# EAGLE board Envelope (EAGLE 7.7.0)
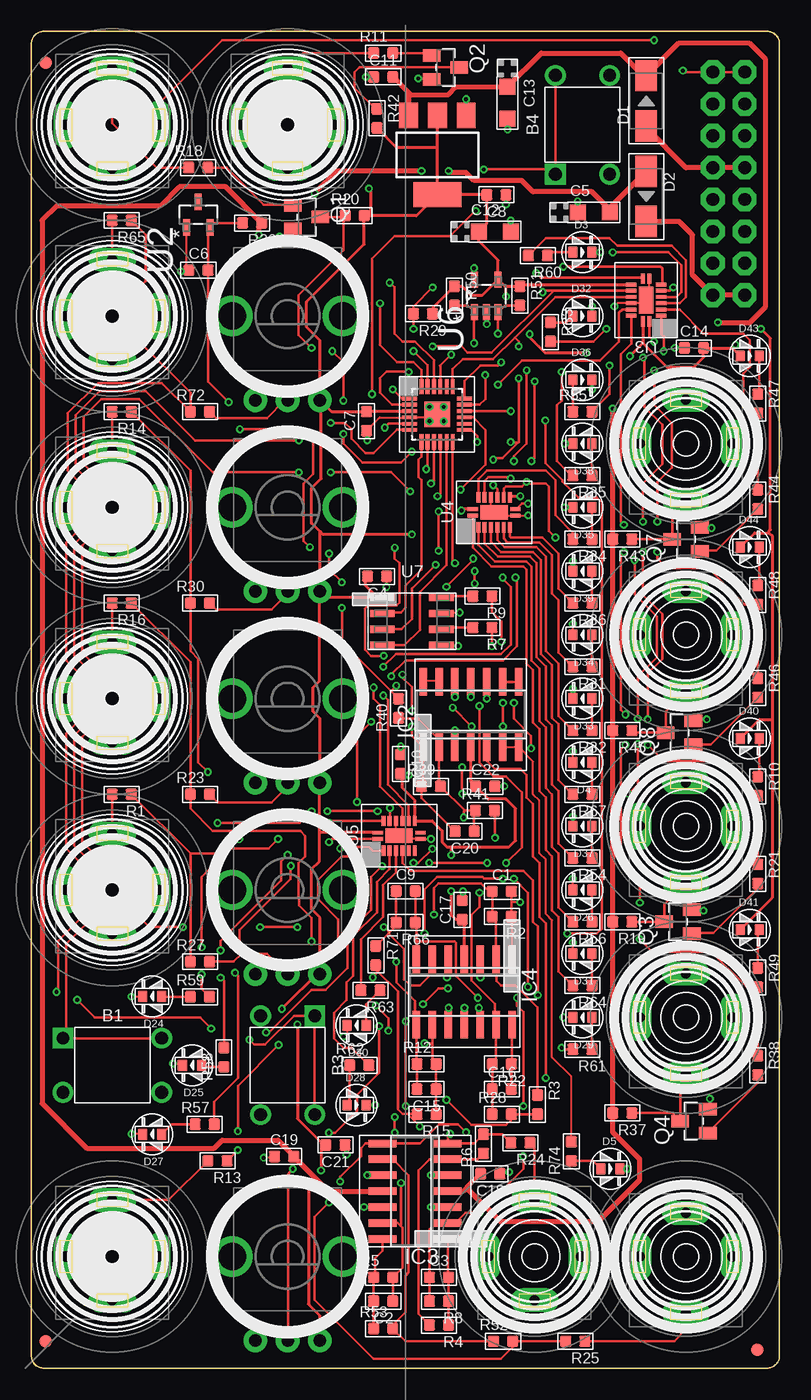
[diagram p2: board, top side]
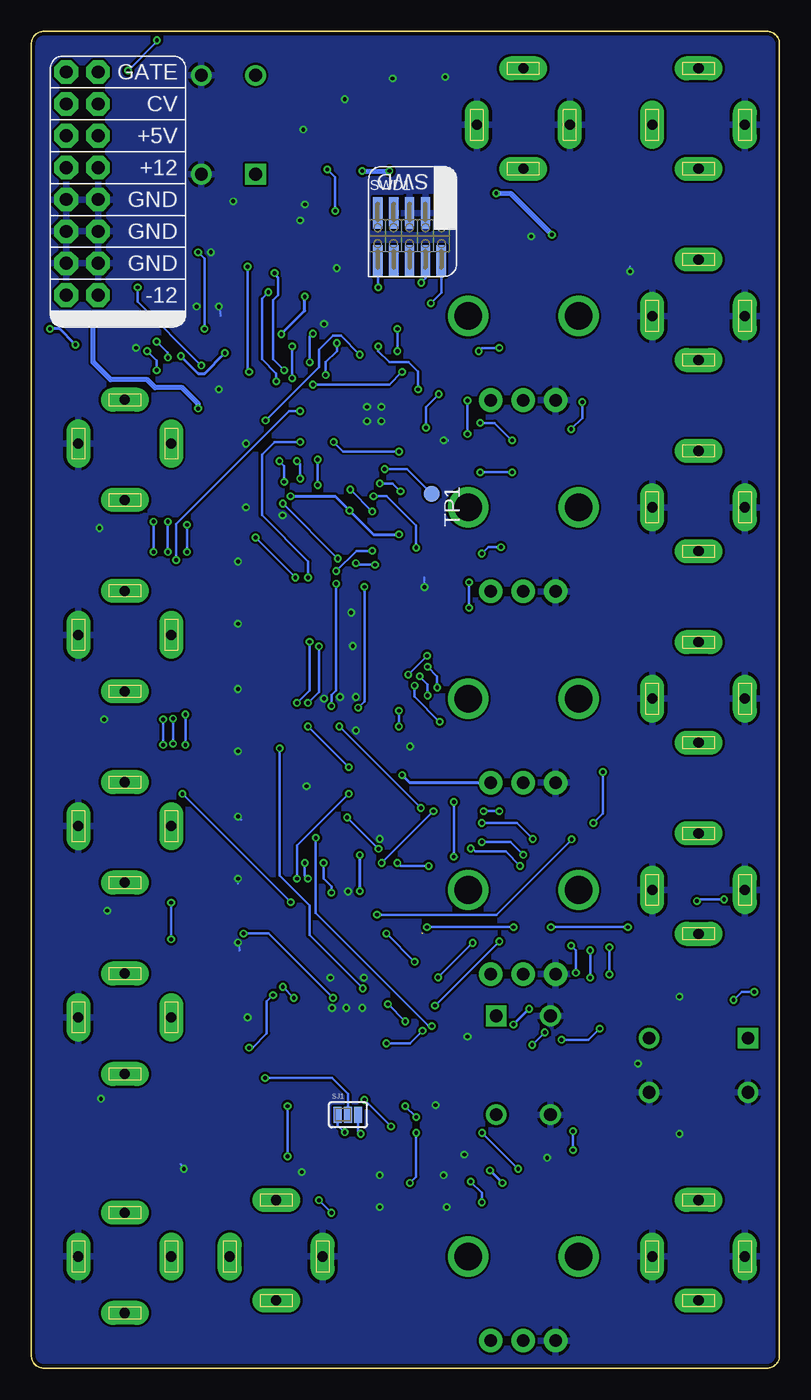
[diagram p3: board, bottom side, seen from below]

Size 59.62 x 106.5 mm. Coordinates in mm from the lower left corner, seen from the top.
Copper layers (1*16): Top 0.035mm / dielectric 1.5mm / Bottom 0.035mm
Design rules "dirt_cheap_dirty_boards.v1 *": minimum track width 5mil, minimum drill 12mil, track to track 5mil, track to pad 5mil, pad to pad 5mil, via to via 5mil, smd to smd 0mil, copper to edge 10mil, drill to drill 10mil, minimum pad ring 10mil, minimum via ring 6mil, stop-mask expansion 2mil, vias tented up to drill 25mil, thermal gap 10mil
Net classes: 0 default: width 0.203 mm, clearance 0.178 mm; 1 heavypower: width 0.381 mm; 2 mediumpower: width 0.254 mm; 3 groundplane: width 0.178 mm, clearance 0.178 mm

## Footprints (pad centres in the part's own frame; a part is rotated, then mirrored left to right if it is on the bottom)
4P-6.0X6.0X5.0H = drill 1.016 pad 1.651 square: 1 -3.937,2.159 | drill 1.016 pad 1.651: 2 -3.937,-2.159; 3 3.937,-2.159; 4 3.937,2.159
C0603 = smd 0.889 x 0.889: 1 -0.762,0; 2 0.762,0
AVX-A = smd 1.27 x 1.27: + -1.27,0; - 1.27,0
DO-214AC = smd 2.5 x 1.7: 1 -2,0; 2 2,0
LED0603 = smd 0.762 x 0.889: + -0.762,0; - 0.762,0
FIDUCIAL_1MM = smd 1 x 1: 1 0,0
SOT223 = smd 1.5 x 2: 1 -2.3,-3.15; 2 0,-3.15; 3 2.3,-3.15 | smd 3.8 x 2: 4 0,3.15
SO14 = smd 0.6 x 2.2: 1 -3.81,-2.6; 2 -2.54,-2.6; 3 -1.27,-2.6; 4 0,-2.6; 5 1.27,-2.6; 6 2.54,-2.6; 7 3.81,-2.6; 8 3.81,2.6; 9 2.54,2.6; 10 1.27,2.6; 11 0,2.6; 12 -1.27,2.6; 13 -2.54,2.6; 14 -3.81,2.6
3.5MM-JACK-SWITCH-13MM-INPUT = drill 0.8 pad 1.93 long: RING@3 -3.7,0; SECOND@3 0,-3.5; SWITCH@3 3.7,0; TIP@3 0,4.5
3.5MM-JACK-SWITCH-13MM-OUTPUT = drill 0.8 pad 1.93 long: RING@3 -3.7,0; SECOND@3 0,-3.5; SWITCH@3 3.7,0; TIP@3 0,4.5
POWER_16 = drill 1.016 pad 1.88 octagon: 1 -6.35,-1.27; 2 -6.35,1.27; 3 -3.81,-1.27; 4 -3.81,1.27; 5 -1.27,-1.27; 6 -1.27,1.27; 7 1.27,-1.27; 8 1.27,1.27; 9 3.81,-1.27; 10 3.81,1.27; 11 6.35,-1.27; 12 6.35,1.27; 13 8.89,-1.27; 14 8.89,1.27; 15 11.43,-1.27; 16 11.43,1.27
SOT23-BEC = smd 1 x 1.4: B -0.95,-1.1; C 0,1.1; E 0.95,-1.1
R0603 = smd 0.889 x 0.889: 1 -0.762,0; 2 0.762,0
OG-POTS_ALPS_POT_VERTICAL = drill 1 pad 1.88: P$1 -2.58,-6.7; P$2 0,-6.7; P$3 2.58,-6.7 | drill 2.2 pad 3.175: P$4 4.4,0; P$5 -4.4,0
SJ_3_PASTE1&2 = smd 0.635 x 1.27: 1 -0.813,0; 2 0,0; 3 0.813,0
M50-3600542 = smd 0.75 x 2.5: 1 -2.54,-1.81; 2 -2.54,2; 3 -1.27,-1.81; 4 -1.27,2; 5 0,-1.81; 6 0,2; 7 1.27,-1.81; 8 1.27,2; 9 2.54,-1.81; 10 2.54,2
B1,27 = smd 1.27 x 1.27: TP 0,0
QFN50P400X400X100-25N = smd 1.2 x 0.3: 1 -2.2,1.245; 2 -2.2,0.762; 3 -2.2,0.254; 4 -2.2,-0.254; 5 -2.2,-0.762; 6 -2.2,-1.245; 13 2.2,-1.245; 14 2.2,-0.762; 15 2.2,-0.254; 16 2.2,0.254; 17 2.2,0.762; 18 2.2,1.245 | smd 0.3 x 1.2: 7 -1.245,-2.2; 8 -0.762,-2.2; 9 -0.254,-2.2; 10 0.254,-2.2; 11 0.762,-2.2; 12 1.245,-2.2; 19 1.245,2.2; 20 0.762,2.2; 21 0.254,2.2; 22 -0.254,2.2 | smd 0.305 x 1.2: 23 -0.762,2.2; 24 -1.245,2.2 | smd 2.032 x 2.032: 25 0,0
SOT95P237X112-3N = smd 1.321 x 0.559: 1 -1.016,0.94; 2 -1.016,-0.94; 3 1.016,0
QFN50P250X350X100-17N = smd 0.305 x 0.813: 1 -0.254,1.702; 8 -0.254,-1.702; 9 0.254,-1.702; 16 0.254,1.702 | smd 0.813 x 0.305: 2 -1.194,1.245; 3 -1.194,0.762; 4 -1.194,0.254; 5 -1.194,-0.254; 6 -1.194,-0.762; 7 -1.194,-1.245; 10 1.194,-1.245; 11 1.194,-0.762; 12 1.194,-0.254; 13 1.194,0.254; 14 1.194,0.762; 15 1.194,1.245 | smd 1.143 x 2.159: 17 0,0
SOT95P290X145-5N = smd 1.27 x 0.559: 1 -1.295,0.94; 2 -1.295,0; 3 -1.295,-0.94; 4 1.295,-0.94; 5 1.295,0.94
SOIC8-N_MC = smd 1.981 x 0.559: 1 -2.362,1.905; 2 -2.362,0.635; 3 -2.362,-0.635; 4 -2.362,-1.905; 5 2.362,-1.905; 6 2.362,-0.635; 7 2.362,0.635; 8 2.362,1.905

## Placement (x,y rotation side)
B1  BUTTON-4P-3110040P1  [4P-6.0X6.0X5.0H]  6.45,24.13 0 top
B3  BUTTON-4P-3110040P1  [4P-6.0X6.0X5.0H]  20.42,24.13 270 top
B4  BUTTON-4P-3110040P1  [4P-6.0X6.0X5.0H]  43.91,99.06 90 top
C1  3.3nF  [C0603]  37.49,37.98 0 top
C2  3.3nF  [C0603]  28.04,5.33 180 top
C3  3.3nF  [C0603]  32.48,7.24 0 top
C4  100nF  [C0603]  27.55,63.08 180 top
C5  10uF  [AVX-A]  44.82,92.08 0 top
C6  100nF  [C0603]  13.31,87.47 0 top
C7  100nF  [C0603]  26.7,75.45 90 top
C8  100nF  [C0603]  37.06,93.47 180 top
C9  3.3nF  [C0603]  29.83,38 0 top
C10  100nF  [C0603]  29.4,48.12 270 top
C11  100nF  [C0603]  28.04,102.87 0 top
C12  10uF  [AVX-A]  36.93,90.55 0 top
C13  10uF  [AVX-A]  37.93,100.8 270 top
C14  100nF  [C0603]  52.8,81.28 0 top
C15  3.3nF  [C0603]  31.49,22.23 180 top
C16  3.3nF  [C0603]  37.49,22.23 0 top
C17  100nF  [C0603]  34.33,36.5 90 top
C18  100nF  [C0603]  36.57,15.49 180 top
C19  100nF  [C0603]  20.14,16.86 0 top
C20  3.3nF  [C0603]  34.52,42.77 180 top
C21  100nF  [C0603]  24.23,17.78 180 top
C22  100nF  [C0603]  36.17,46.35 0 top
D1  MRA4004T3G  [DO-214AC]  48.99,100.97 90 top
D2  MRA4004T3G  [DO-214AC]  48.99,93.34 270 top
D3  yellow  [LED0603]  43.91,88.9 0 top
D4  yellow  [LED0603]  43.91,48.26 180 top
D5  yellow  [LED0603]  46.14,15.88 0 top
D24  yellow  [LED0603]  9.62,29.62 180 top
D25  yellow  [LED0603]  12.8,24.13 180 top
D26  yellow  [LED0603]  43.91,38.1 180 top
D27  yellow  [LED0603]  9.62,18.63 180 top
D28  yellow  [LED0603]  25.92,20.95 0 top
D29  yellow  [LED0603]  43.91,27.94 180 top
D30  yellow  [LED0603]  25.92,27.3 180 top
D31  yellow  [LED0603]  43.91,33.02 180 top
D32  yellow  [LED0603]  43.91,83.82 0 top
D33  yellow  [LED0603]  43.91,53.34 180 top
D34  yellow  [LED0603]  43.91,58.42 180 top
D35  yellow  [LED0603]  43.91,68.58 180 top
D36  yellow  [LED0603]  43.91,78.74 0 top
D37  yellow  [LED0603]  43.91,43.18 180 top
D38  yellow  [LED0603]  43.91,73.66 180 top
D39  yellow  [LED0603]  43.91,63.5 180 top
D40  yellow  [LED0603]  57.25,50.16 0 top
D41  yellow  [LED0603]  57.25,34.92 0 top
D43  yellow  [LED0603]  57.25,80.64 0 top
D44  yellow  [LED0603]  57.25,65.41 0 top
FID1  FIDUCIAL  [FIDUCIAL_1MM]  1.15,104.01 180 top
FID2  FIDUCIAL  [FIDUCIAL_1MM]  57.86,1.46 0 top
FID3  FIDUCIAL  [FIDUCIAL_1MM]  1.13,2.13 0 top
IC1  LD1117AS33TR  [SOT223]  32.36,96.65 180 top
IC2  MCP6004  [SO14]  35.02,52.07 0 top
IC3  TL074D  [SO14]  30.58,14.1 90 top
IC4  MCP6004  [SO14]  34.49,29.98 180 top
J1  PJ-341  [3.5MM-JACK-SWITCH-13MM-INPUT]  6.45,68.58 0 top
J2  PJ-341  [3.5MM-JACK-SWITCH-13MM-INPUT]  6.45,53.34 0 top
J3  PJ-341  [3.5MM-JACK-SWITCH-13MM-INPUT]  6.45,38.1 0 top
J4  PJ-341  [3.5MM-JACK-SWITCH-13MM-INPUT]  6.45,8.89 0 top
J5  PJ-341  [3.5MM-JACK-SWITCH-13MM-INPUT]  6.45,99.06 0 top
J6  PJ-341  [3.5MM-JACK-SWITCH-13MM-INPUT]  20.42,99.06 0 top
J7  PJ-341  [3.5MM-JACK-SWITCH-13MM-OUTPUT]  52.17,43.18 180 top
J8  PJ-341  [3.5MM-JACK-SWITCH-13MM-OUTPUT]  52.17,27.94 180 top
J10  PJ-341  [3.5MM-JACK-SWITCH-13MM-OUTPUT]  52.17,73.66 180 top
J11  PJ-341  [3.5MM-JACK-SWITCH-13MM-OUTPUT]  52.17,58.42 180 top
J12  PJ-341  [3.5MM-JACK-SWITCH-13MM-OUTPUT]  40.1,8.89 0 top
J13  PJ-341  [3.5MM-JACK-SWITCH-13MM-OUTPUT]  52.17,8.89 180 top
J14  POWER  [POWER_16]  55.57,91.83 90 bottom
J15  PJ-341  [3.5MM-JACK-SWITCH-13MM-INPUT]  6.45,83.82 0 top
OUTLINE  EURORACK_PCB12HP  [EURORACK12HPPCB]  -0.5,0 0 top
Q1  MMBT3904  [SOT23-BEC]  21.94,91.7 270 top
Q2  MMBT3904  [SOT23-BEC]  32.99,103.63 270 top
Q3  MMBT3904  [SOT23-BEC]  51.53,35.56 90 top
Q4  MMBT3904  [SOT23-BEC]  52.8,19.68 90 top
Q7  MMBT3904  [SOT23-BEC]  52.17,66.04 90 top
Q8  MMBT3904  [SOT23-BEC]  51.66,50.62 90 top
R1  100k  [R0603]  7.2,45.72 180 top
R2  33k  [R0603]  37.49,35.98 180 top
R3  51k  [R0603]  40.34,21 270 top
R4  100k  [R0603]  32.48,3.43 180 top
R5  30k  [R0603]  28.04,7.24 0 top
R6  100k  [R0603]  36.03,17.88 90 top
R7  12k  [R0603]  35.94,59 180 top
R8  30k  [R0603]  32.48,5.33 180 top
R9  12k  [R0603]  35.94,61.5 180 top
R10  56  [R0603]  57.88,46.35 270 top
R11  100k  [R0603]  28.04,104.78 0 top
R12  33k  [R0603]  31.49,24.23 0 top
R13  100k  [R0603]  14.83,16.51 180 top
R14  100k  [R0603]  7.2,76.2 180 top
R15  51k  [R0603]  31.49,20.23 180 top
R16  100k  [R0603]  7.2,60.96 180 top
R17  10kB  [OG-POTS_ALPS_POT_VERTICAL]  20.42,68.58 0 top
R18  100k  [R0603]  13.3,95.65 0 top
R19  10k  [R0603]  47.09,35.56 180 top
R20  10k  [R0603]  25.77,91.81 0 top
R21  100k  [R0603]  57.88,39.37 270 top
R22  33k  [R0603]  37.49,24.23 180 top
R23  33k  [R0603]  13.44,45.72 0 top
R24  100  [R0603]  38.98,17.96 180 top
R25  100  [R0603]  43.35,2.13 180 top
R26  10k  [R0603]  17.59,91.23 180 top
R27  33k  [R0603]  13.44,32.38 0 top
R28  51k  [R0603]  37.49,20.23 0 top
R29  10k  [R0603]  31.2,84 180 top
R30  33k  [R0603]  13.44,60.96 0 top
R31  56  [R0603]  43.91,55.88 180 top
R32  56  [R0603]  43.91,50.8 180 top
R33  56  [R0603]  41.38,82.55 270 top
R34  56  [R0603]  43.91,66.04 180 top
R35  56  [R0603]  43.91,71.12 180 top
R36  56  [R0603]  43.91,60.96 180 top
R37  10k  [R0603]  47.09,20.32 180 top
R38  100k  [R0603]  57.88,24.13 270 top
R39  33k  [R0603]  31.85,46.35 0 top
R40  51k  [R0603]  29.26,52.57 90 top
R41  33k  [R0603]  36.15,44.42 0 top
R42  10k  [R0603]  27.53,99.57 270 top
R43  10k  [R0603]  47.09,66.04 180 top
R44  100k  [R0603]  57.88,69.22 270 top
R45  10k  [R0603]  47.09,50.8 180 top
R46  100k  [R0603]  57.88,54.19 270 top
R47  56  [R0603]  57.88,76.83 270 top
R48  56  [R0603]  57.88,61.59 270 top
R49  56  [R0603]  57.88,31.11 270 top
R50  2k  [R0603]  33.71,85.43 270 top
R51  2k  [R0603]  38.93,85.43 270 top
R52  100k  [R0603]  37.6,2.13 0 top
R53  100k  [R0603]  28.03,3.15 0 top
R54  56  [R0603]  43.91,40.64 180 top
R55  56  [R0603]  43.91,76.2 0 top
R56  56  [R0603]  43.91,35.56 180 top
R57  56  [R0603]  13.82,19.43 0 top
R58  56  [R0603]  15.34,24.77 90 top
R59  56  [R0603]  13.44,29.59 0 top
R60  56  [R0603]  40.36,88.65 180 top
R61  56  [R0603]  43.91,25.4 180 top
R62  56  [R0603]  26.13,24.13 0 top
R63  56  [R0603]  27.02,30.1 180 top
R64  56  [R0603]  43.91,30.48 180 top
R65  100k  [R0603]  7.2,91.44 180 top
R66  33k  [R0603]  29.83,35.5 180 top
R67  56  [R0603]  43.91,45.72 180 top
R68  10kB  [OG-POTS_ALPS_POT_VERTICAL]  20.42,53.34 0 top
R69  10kB  [OG-POTS_ALPS_POT_VERTICAL]  20.42,38.1 0 top
R70  10kB  [OG-POTS_ALPS_POT_VERTICAL]  20.42,8.89 0 top
R71  51k  [R0603]  27.45,32.87 270 top
R72  33k  [R0603]  13.44,76.2 0 top
R73  10kB  [OG-POTS_ALPS_POT_VERTICAL]  20.42,83.82 0 top
R74  56  [R0603]  43.03,17.27 90 top
SJ1  [SJ_3_PASTE1&2]  34.39,20.19 0 bottom
SWD1  CORTEX_SWD  [M50-3600542]  29.48,90.22 180 bottom
TP1  TPB1,27  [B1,27]  27.73,69.66 270 bottom
U1  MKL02Z32VFK4  [QFN50P400X400X100-25N]  32.33,76 0 top
U2  LM4040DIM3-5.0  [SOT95P237X112-3N]  13.3,91.89 90 top
U3  74HC595BQ  [QFN50P250X350X100-17N]  48.99,85.09 180 top
U4  74HC595BQ  [QFN50P250X350X100-17N]  36.88,68.18 90 top
U5  74HC595BQ  [QFN50P250X350X100-17N]  29.31,42.41 90 top
U6  24LC16T-I/OT  [SOT95P290X145-5N]  36.25,85.43 90 top
U7  MCP4822-E/SN  [SOIC8-N_MC]  30.33,59.5 0 top

## Tracks (layer width: path | path; a pad name or v marks a point on that pad's centre or on a via)
3.3V  (via drill 0.3)
  Top 0.254: U6.4 35.94,85.47 35.02,85.47 34.3,86.19 R50.1 31.97,84.44 R29.1 | 55.85,81.28 C14.2 53.57,80.52 52.8,79.76 50.65,79.76 48.74,81.66 | 55.85,81.28 D43.+ | IC4.4 34.49,35.58 C17.1 34.2,35.75 33.83,35.75 33.45,36.12 v33.45,38 | 23.09,77.03 23.91,76.21 C7.2 26.75,76.25 U1.3 | U6.4 37.73,86.19 | 37.73,86.19 R51.1 39.07,86.33 U3.10 | U6.4 37.18,88.27 35.66,89.79 C12.+ 36.3,91.19 C8.2 36.27,93.5 IC1.4 | IC1.4 32.36,97.28 | 32.36,97.28 IC1.2 | R42.2 29.06,97.28 32.36,97.28 | IC1.4 30.68,91.81 27.02,91.81 | 27.02,91.81 R20.2 26.52,91.8 26.52,89.53 21.94,84.96 21.94,82.93 23,81.88 R73.P$3 23.09,77.03 | v26.9,93.98 27.02,93.85 27.02,91.81 | IC2.4 35.02,46.74 C22.1 36.42,45.34 37.82,45.34 38.58,44.58 38.58,42.04 38.07,41.53 33.45,41.53 | U3.16 48.74,81.66 | D44.+ 57.63,66.55 58.65,66.55 | 58.65,66.55 58.77,66.55 59.03,66.29 59.03,51.69 | 59.03,51.69 59.03,37.47 D41.+ | D40.+ 58.01,51.69 59.03,51.69 | 58.65,66.55 58.9,66.8 58.9,82.04 v58.14,82.8 | 55.85,81.28 v56.11,81.53 | 23,62.48 R17.P$3 23.48,61.41 U7.1 27.59,61.41 26.64,62.36 26.64,62.93 C4.2 | 23,62.48 23,66.64 | 23,66.64 22.33,67.31 22.33,70.1 23.09,70.87 23.09,77.03 | 22.96,42.67 22.96,40.39 22.33,39.75 22.33,36.58 23,35.9 R69.P$3 22.95,31.62 v19.95,28.62 | 22.96,42.67 22.96,46.6 R68.P$3 23,51.78 22.45,52.32 22.45,54.23 22.96,54.74 22.96,62.44 23,62.48 | U5.16 22.97,42.66 22.96,42.67 | U4.16 34.37,68.43 v34.26,68.33 | v30.33,66.42 23.21,66.42 23,66.64 | 33.45,41.53 33.12,41.53 32.74,41.91 32.74,42.8 31.93,43.6 U5.10 30.55,45.24 29.56,46.23 29.56,47.2 | 29.56,47.2 C10.2 | 29.56,47.2 29.61,47.24 v30.07,47.24 | U4.10 38.22,69.47 v38.96,69.47
  Top 0.254: v21.2,27.38 21.2,19.88 23.2,17.88 23.45,17.88 C21.2 23.08,17.88 v23.08,15.75 | 33.45,41.53 v33.45,40.88 | v22.08,14.75 22.08,5.09 22.95,4.21 22.95,2.25 R70.P$3 | v37.83,85.38 37.83,86.12 37.73,86.19 | v39.7,82.38 39.7,82.12 40.95,80.88 v44.2,80.88 | 48.74,81.66 v47.7,80.62
  Bottom 0.254: SWD1.1 26.9,92.08 v26.9,93.98 | v56.11,81.53 57.38,82.8 v58.14,82.8 | v30.33,66.42 32.36,66.42 v34.26,68.33 35.41,69.47 v38.96,69.47 | v30.07,47.24 29.47,46.64 R68.P$3 | v19.95,28.62 v21.2,27.38 | v33.45,40.88 v33.45,38 | v23.08,15.75 v22.08,14.75 | v37.83,85.38 37.83,84.25 v39.7,82.38 | v44.2,80.88 45.83,79.25 46.33,79.25 v47.7,80.62
12V  (via drill 0.3)
  Top 0.381: C18.2 34.69,14.37 | 34.69,14.37 34.42,14.1 IC3.4 | C11.2 30.06,101.61 | 30.06,101.61 IC1.3 | 30.06,101.61 30.2,101.47 33.25,101.47 33.85,102.07 C13.+ 40.63,104.78 46.96,104.78 48.77,102.97 D1.2 51.57,105.54 57.25,105.54 58.52,104.27 58.52,84.58 57.25,83.31 v54.71,83.31 | 34.69,14.37 37.38,11.68 45.18,11.68 48.49,14.99 48.49,16.64 46.33,18.8 R37.2 R19.2 R45.2 R43.2 v46.33,76.45
  Bottom 0.381: v46.33,76.45 46.33,76.83 47.6,78.11 49.76,78.11 50.39,78.74 53.31,78.74 54.71,80.14 v54.71,83.31
-12V  (via drill 0.3)
  Top 0.381: IC3.11 23.67,14.1 C19.2 20.9,16.92 19.66,18.16 15.21,18.16 14.58,17.53 4.42,17.53 0.86,21.08 0.86,91.44 2,92.58 10.26,92.58 11.78,94.11 15.49,94.11 R26.1 18.13,91.01 v18.13,90.3 | D2.1 46.09,92.44 C5.- 46.09,92.31 44.68,93.73 39.98,93.73 39.09,94.61 35.28,94.61 34.64,95.25 33.37,95.25 v33.25,95.38 | v31.09,95.38 24.36,95.38 v22.58,93.6
  Bottom 0.381: v33.25,95.38 v31.09,95.38 | v22.58,93.6 21.44,93.6 v18.13,90.3
ADC_ATTACK  (via drill 0.3)
  Top 0.203: U1.21 32.58,79.86 32.58,79.88 v33.45,80.75 | IC4.7 30.68,34 | 30.68,34 30.68,35.41 R66.1 C9.2 | v40.95,75.5 40.95,72.12 42.33,70.75 42.33,70.62 43.58,69.38 45.08,69.38 45.45,69 45.45,35 45.08,34.62 v42.7,34.62 | v35.58,29.5 33.83,31.25 33.83,33.88 33.7,34 30.68,34
  Bottom 0.203: v33.45,80.75 34.95,82.25 35.58,82.25 36.7,81.12 36.7,79.75 v40.95,75.5 | v42.7,34.62 40.7,34.62 v35.58,29.5
ADC_CURVE  (via drill 0.3)
  Top 0.203: C20.2 31.09,45.44 R39.1 31.21,46.48 IC2.1 31.2,49.5 30.33,50.38 v30.33,51.12 | U1.10 32.58,69.69 v32.36,69.47 | v28.95,65.37 28.95,64.5 29.33,64.12 29.33,61 29.08,60.75 26.83,60.75 26.58,60.5 26.58,57.25 27.08,56.75 v28.08,56.75 | v29.58,55.25 29.58,55 30.33,54.25 v30.33,52.38
  Bottom 0.203: v32.36,69.47 31.3,69.47 28.95,67.12 v28.95,65.37 | v29.58,55.25 v28.08,56.75 | v30.33,51.12 v30.33,52.38
ADC_DECAY
  Top 0.203: IC4.14 38.3,24.28 R22.1 C16.2
ADC_RELEASE  (via drill 0.3)
  Top 0.203: IC4.1 38.3,35.93 R2.1 38.25,37.12 | C1.2 38.25,37.12 | v38.2,76.25 U1.16 | v48.08,64.38 48.08,61.62 49.83,59.88 49.83,56.62 48.33,55.12 v48.33,51.75 | v48.33,49.75 48.33,46.5 v47.58,45.75 | 38.25,37.12 v38.95,37.12
  Bottom 0.203: v38.2,76.25 39.08,76.25 48.08,67.25 v48.08,64.38 | v48.33,49.75 v48.33,51.75 | v38.95,37.12 v47.58,45.75
ADC_SUSTAIN  (via drill 0.3)
  Top 0.203: C15.2 R12.1 30.68,24.28 IC4.8 30.58,27.5 30.58,29.25 29.08,30.75 v29.08,32.38 | v34.2,70 36.2,72 36.2,74.75 35.2,75.75 34.58,75.75 U1.15 | v32.45,65.11 v32.45,68.25 | v35.33,62.5 v35.33,63.5 | v35.7,52.75 35.7,48.25 36.83,47.12 37.83,47.12 39.08,45.88 39.08,41.5 v37.83,40.25 | v37.58,39 36.08,39 35.95,39.12 32.33,39.12 31.33,38.12 v31.33,34.62
  Bottom 0.203: v32.45,68.25 v34.2,70 | v35.33,62.5 35.33,54 35.7,53.62 v35.7,52.75 | v37.83,40.25 37.83,39.25 v37.58,39 | v29.08,32.38 v31.33,34.62 | v32.45,65.11 33.71,65.11 v35.33,63.5
BUTTON_LOOP  (via drill 0.3)
  Top 0.203: B3.4 B3.1 20.93,28.07 18.64,25.78 17.75,25.78 v17.37,26.16 | U1.6 29.13,74.75 27.28,72.9 26.64,72.9 25.5,74.04 25.5,74.8 24.99,75.31 v23.85,75.31 | v21.31,73.91 13.05,73.91 9.12,77.85 5.43,77.85 3.53,75.95 3.53,71.75 4.67,70.61 4.67,66.93 3.4,65.66 3.4,56.77 4.8,55.37 4.8,51.82 3.4,50.42 3.4,41.66 5.05,40.01 5.05,36.96 2.13,34.04 2.13,30.1 v2,29.97 | v14.32,27.05 13.44,27.94 5.05,27.94 v3.66,29.34
  Bottom 0.203: v23.85,75.31 22.71,75.31 v21.31,73.91 | v17.37,26.16 15.21,26.16 v14.32,27.05 | v3.66,29.34 3.02,29.97 v2,29.97
BUTTON_TIMERANGE  (via drill 0.3)
  Top 0.203: B1.4 B1.1 2.77,26.54 2.77,33.78 5.69,36.7 5.69,40.26 4.04,41.91 4.04,50.29 5.43,51.69 5.43,55.63 4.04,57.02 4.04,65.53 5.18,66.67 5.18,70.99 4.16,72.01 4.16,75.82 5.56,77.22 8.61,77.22 14.45,71.37 v21.31,71.37 | U1.9 32.08,70.71 v31.85,70.48 | v30.2,69.85 28.67,71.37 v23.85,71.37
  Bottom 0.203: v31.85,70.48 30.83,70.48 v30.2,69.85 | v23.85,71.37 v21.31,71.37
BUTTON_TRIGGER  (via drill 0.3)
  Top 0.203: B4.4 B4.1 41.38,95.5 v36.04,95.5 | U1.5 28.48,75.24 v28.17,74.93 | v27.15,77.6 27.15,88.39 28.93,90.17 33.37,90.17 v35.41,92.2
  Bottom 0.203: v28.17,74.93 28.17,76.58 v27.15,77.6 | v35.41,92.2 35.41,94.87 v36.04,95.5
CLOCK  (via drill 0.3)
  Top 0.203: U1.1 29.53,77.25 v28.8,77.98 | U3.11 41.63,85.85 | 41.63,85.85 36.68,80.9 34.77,80.9 34.26,81.41 v31.98,81.41 | v39.85,72.26 40.1,72.52 v40.1,78.61 | U4.11 37.64,70.06 37.82,70.23 39.09,70.23 v39.47,70.61 39.6,70.48 40.99,70.48 41.25,70.23 41.25,66.67 v41.76,66.17 | 41.63,85.85 40.87,85.85 v40.74,85.72 | U5.11 30.07,44.83 28.42,46.48 28.42,53.21 v28.04,53.59 | v28.67,55.12 28.67,55.24 29.82,56.39 37.56,56.39 38.71,57.53 38.71,62.87 v38.58,62.99
  Bottom 0.203: v31.98,81.41 31.98,81.03 31.09,80.14 29.56,80.14 28.8,79.38 v28.8,77.98 | v39.47,70.61 39.47,71.88 v39.85,72.26 | v40.1,78.61 40.1,79.25 41.25,80.39 41.25,85.22 v40.74,85.72 | v28.04,53.59 28.04,54.48 v28.67,55.12 | v38.58,62.99 v41.76,66.17
CPU_RESET  (via drill 0.3)
  Top 0.203: v31.98,86.11 30.44,84.57 R29.2 30.45,83.99 v30.45,82.8 | U1.23 31.57,79.91 v30.45,81.03
  Bottom 0.203: SWD1.10 31.98,88.18 v31.98,86.11 | v30.45,81.03 v30.45,82.8
D21
  Top 0.203: D43.- 58.01,77.72 R47.1
DACCS
  Top 0.203: U7.2 28.03,60.2 29.44,60.2 29.82,60.58 29.82,62.36 31.09,63.63 31.09,70.74 30.83,70.99 30.83,72.39 31.09,72.64 U1.7
DACSCK  (via drill 0.3)
  Top 0.203: U7.3 29.5,58.87 30.33,59.69 30.33,62.1 v32.23,64.01 | U1.12 33.57,64.31 v33.75,64.14
  Bottom 0.203: v32.23,64.01 33.63,64.01 v33.75,64.14
DACSDI
  Top 0.203: U7.4 29.76,57.59 30.96,58.8 30.96,61.85 33.09,63.98 U1.11
EXTGATE  (via drill 0.3)
  Top 0.203: J14.16 J14.15 52.03,103.27 v51.92,103.38 | v49.62,105.79 15.21,105.79 10.15,100.73 J5.SWITCH@3
  Bottom 0.203: v49.62,105.79 49.62,105.67 v51.92,103.38
GND  (via drill 0.3)
  Top 0.178: Q8.E 52.87,51.69 v53.82,51.69 | C18.1 37.47,15.62 v38.07,15.62 | IC3.5 v31.85,15.37 | IC3.3 v31.85,12.83 | D27.- 8.82,18.67 v7.97,18.67 | D25.- 11.91,24.26 v11.28,24.26 | D24.- 8.83,29.59 v7.97,29.59 | IC3.12 v26.52,12.83 | IC3.10 v26.77,15.37 | C21.1 25.12,17.65 v25.12,17.02 | D28.- v27.41,20.95 | D29.- v42.39,27.94 | D31.- v43.15,33.91 | D26.- v43.15,38.99 | D37.- v43.15,43.94 | D4.- v43.15,49.15 | D33.- v43.15,54.1 | D34.- v43.15,59.31 | D39.- v43.15,64.26 | D35.- v42.52,68.58 | D38.- v42.52,73.66 | D36.- v44.68,77.98 | D3.- v45.31,88.9 | D32.- v44.68,84.58 | Q2.E 30.89,102.68 v30.83,102.74 | C11.1 v26.64,102.87 | IC1.1 34.66,101.08 v34.64,101.09 | C13.- 37.93,98.69 v37.95,98.68 | C12.- v38.2,91.44 | C8.1 v37.82,92.71 | C5.+ 43.55,92.95 v43.53,92.96 | C19.1 19.28,16.76 v18.52,16.76 | C17.2 34.39,37.32 v34.39,37.97 | U5.13 29.06,42.66 U5.17 29.57,42.41 29.82,42.16 U5.8 v31.84,42.16 v31.85,42.16 | Q4.E 54.07,20.8 v54.07,21.46 | Q3.E 52.7,36.45 v53.57,36.45 | Q7.E 53.33,66.93 v54.2,66.93 | U6.2 36.3,84.09 v36.3,83.19 | U6.5 35.28,86.76 v35.28,87.63 | U2.1 12.36,87.66 C6.1 12.45,87.38 v11.91,87.38 | C22.2 v37.69,46.35 | C10.1 29.44,48.92 v29.44,49.53 | U7.7 32.75,60.2 v34.14,60.2 | U7.5 32.76,57.53 v34.01,57.53 | U1.25 32.08,75.75 U1.4 27.76,75.75 C7.1 26.77,74.62 v26.77,73.91 | C14.1 v51.28,81.28 | U3.8 49.25,85.34 U3.17 48.74,84.84 U3.13 46.71,84.84 v46.45,84.58 | Q1.E 20.26,90.17 v19.78,90.17 | U4.13 36.63,68.43 U4.17 37.13,67.93 U4.8 39.58,67.93 v39.6,67.94 | IC4.5 33.22,31.21 v33.12,31.11 | IC4.3 35.76,31.14 v35.79,31.11 | IC4.10 33.22,28.68 v33.25,28.7 | IC4.11 34.49,28.68 v34.52,28.7 | IC4.12 35.76,28.6 v35.66,28.7 | D5.- v47.47,15.88
  Top 0.178: IC2.10 v36.3,53.34 | IC2.11 v35.02,53.47 | IC2.12 v33.75,53.47 | IC2.3 v33.75,50.8 | D30.- 25.16,26.71 v24.87,26.42 | C4.1 28.31,63.01 v28.29,62.23
  Bottom 0.178: v53.82,51.69 53.95,51.69 | v38.07,15.62 38.07,15.88 | v31.85,15.37 31.72,15.37 | v31.85,12.83 31.72,12.83 | v7.97,18.67 7.72,18.67 | v11.28,24.26 11.02,24.26 | v7.97,29.59 7.85,29.59 | v26.52,12.83 26.39,12.83 | v26.77,15.37 26.52,15.37 | v25.12,17.02 25.12,16.76 | v27.41,20.95 27.53,20.95 | v42.39,27.94 42.14,27.94 | v43.15,33.91 43.03,33.27 | v43.15,38.99 43.15,38.61 | v43.15,43.94 42.9,43.69 | v43.15,49.15 43.03,49.02 | v43.15,54.1 43.03,54.1 | v43.15,59.31 43.15,59.18 | v43.15,64.26 43.03,64.14 | v42.52,68.58 42.39,68.58 | v42.52,73.66 42.39,73.66 | v44.68,77.98 44.68,78.11 | v45.31,88.9 45.44,88.9 | v44.68,84.58 44.55,83.82 | v30.83,102.74 30.71,102.87 | v26.64,102.87 26.39,102.87 | v34.64,101.09 34.64,101.22 | v37.95,98.68 37.95,98.55 | v38.2,91.44 38.2,91.57 | v37.82,92.71 37.82,92.84 | v43.53,92.96 43.53,93.09 | v18.52,16.76 18.26,16.76 | v34.39,37.97 34.39,38.23 | v54.07,21.46 54.33,21.46 | v53.57,36.45 53.82,36.45 | v54.2,66.93 54.33,66.93 | v36.3,83.19 36.3,83.06 | v35.28,87.63 35.28,87.88 | v37.69,46.35 37.82,46.35 | v29.44,49.53 29.44,49.66 | v28.29,62.23 28.29,62.99 | v34.14,60.2 34.26,60.2 | v34.01,57.53 34.14,57.66 34.26,57.66 | v26.77,73.91 26.39,73.91 | v11.91,87.38 11.91,87.76 | v51.28,81.28 51.15,81.28 | v19.78,90.17 19.66,90.04 | v39.6,67.94 39.85,67.94 | v33.12,31.11 33.25,30.99 | v35.79,31.11 35.66,31.24 | v33.25,28.7 33.25,28.83 | v34.52,28.7 34.39,28.7 | v35.66,28.7 35.79,28.7 | v47.47,15.88 47.47,16 47.73,16.26 | v46.45,84.58 46.58,84.58 | v36.3,53.34 36.3,53.21 | v35.02,53.47 35.02,53.34 | v33.75,53.47 33.75,53.34 | v33.75,50.8 33.75,51.05 | v24.87,26.42 24.74,26.29
  other vias: 31.72,76.58 32.87,76.58 32.87,75.44 31.72,75.44
  pour Bottom: -2.7,109.29 -2.7,-2.47 61.33,-2.54 61.33,109.22
KNOB_ATTACK
  Top 0.203: R72.2 14.71,75.69 18.77,75.69 20.2,77.12 R73.P$2
KNOB_CURVE  (via drill 0.3)
  Top 0.203: v36.95,42.25 36.95,44.38 R41.2 | v27.7,27.25 27.7,23.5 25.96,21.76 25.96,20.5 24.2,18.75 v23.7,18.75 | v20.83,15.88 20.45,15.45 20.45,2.25 R70.P$2
  Bottom 0.203: v36.95,42.25 36.95,36.25 27.95,27.25 v27.7,27.25 | v20.83,15.88 v23.7,18.75
KNOB_DECAY
  Top 0.203: R30.2 14.71,60.45 19.15,60.45 20.42,61.72 R17.P$2
KNOB_RELEASE
  Top 0.203: R27.2 16.1,32.38 16.74,33.02 18.8,33.02 R69.P$2
KNOB_SUSTAIN
  Top 0.203: R23.2 14.83,45.09 19.15,45.09 20.42,46.35 R68.P$2
LATCH  (via drill 0.3)
  Top 0.203: U3.12 41.76,85.34 38.52,82.11 | 38.52,82.11 36.8,80.39 34.39,80.39 33.57,79.58 U1.19 | U4.12 37.13,70.03 v36.8,70.36 | v36.8,72.39 36.8,72.52 37.56,72.52 38.77,73.72 | 38.77,73.72 38.84,73.79 v38.84,78.87 | v38.84,81.41 38.84,81.79 38.52,82.11 | U5.12 29.56,44.58 27.79,46.35 27.79,52.83 27.28,53.34 v27.28,54.23 | v28.04,55.88 29.06,56.9 37.44,56.9 38.2,57.66 38.2,62.23 37.56,62.87 v37.56,62.99 | v38.2,73.79 38.26,73.72 38.77,73.72
  Bottom 0.203: v36.8,70.36 v36.8,72.39 | v38.84,78.87 v38.84,81.41 | v27.28,54.23 27.28,55.12 v28.04,55.88 | v37.56,62.99 37.56,64.26 41.25,67.94 41.25,72.77 40.23,73.79 v38.2,73.79
N$1
  Top 0.203: IC2.9 IC2.8
N$2
  Top 0.203: R6.1 35.55,16.64 IC3.6 31.72,16.64 30.83,15.75 30.83,4.32 31.47,3.68 31.72,3.68 R4.2
N$3
  Top 0.203: J2.TIP@3 6.44,57.85 R16.2
N$4  (via drill 0.3)
  Top 0.203: 31.95,25.88 31.95,24.53 R12.2 C15.1 R15.1 | 31.95,25.88 IC4.9 | R16.1 12.67,56.25 R23.1 12.67,44.58 14.45,42.8 21.44,42.8 21.82,42.42 21.82,40.77 21.31,40.26 21.31,37.47 21.33,37.38 21.33,36.88 22.33,35.88 v22.33,34 | v31.33,25.88 31.95,25.88 | v28.45,26.88 28.45,27.88 v27.45,28.88 | 31.95,25.88
  Bottom 0.203: v31.33,25.88 29.45,25.88 v28.45,26.88 | v22.33,34 v27.45,28.88
N$5
  Top 0.203: U7.8 32.79,61.5 R9.2
N$6
  Top 0.203: J3.TIP@3 6.44,42.61 R1.2
N$7
  Top 0.203: U7.6 32.83,59 R7.2
N$8  (via drill 0.3)
  Top 0.203: R1.1 12.67,41.01 12.67,41 | 12.67,41 R27.1 | R3.1 40.34,28.72 38.58,30.48 37.44,30.48 37.06,30.86 37.06,32.55 IC4.2 37.03,35.68 R2.2 C1.1 36.7,37.75 35.83,38.62 32.45,38.62 32.08,38.25 v32.08,36.12 | 12.67,41 14.7,41 15.83,42.13 v16.56,42.13
  Bottom 0.203: v16.56,42.13 22.56,36.12 v32.08,36.12
N$9  (via drill 0.3)
  Top 0.203: C2.1 R5.2 29.56,8 29.56,11.18 29.41,11.33 | 29.41,11.33 29.18,11.56 IC3.13 | v37.45,57.88 37.45,59.5 36.7,60.25 36.7,61.38 R9.1 | v38.45,53 38.45,51.75 39.83,50.38 v39.83,49.38 | v33.2,30.25 32.45,30.25 v31.2,29 | v29.83,20.88 v29.83,27.62 | v28.95,18.75 v28.95,20 | v29.45,14.75 29.45,11.38 29.41,11.33
  Bottom 0.203: v37.45,57.88 37.45,54 v38.45,53 | v39.83,49.38 39.83,39.25 37.45,36.88 37.45,34.5 v33.2,30.25 | v29.83,27.62 v31.2,29 | v28.95,20 v29.83,20.88 | v28.95,18.75 28.95,15.25 v29.45,14.75
N$10  (via drill 0.3)
  Top 0.203: R8.2 C3.1 31.72,11.05 32.23,11.56 IC3.2 33.2,11.62 33.83,11.62 34.58,12.38 v35.7,12.38 | v36.7,57.5 36.7,58.88 R7.1 | v37.58,51.12 v37.58,53 | v34.33,45.75 v34.33,47.88 | v38.45,39 39.58,37.88 v39.58,30.38 | v38.7,29.5 38.7,28.88 39.2,28.38 v39.2,20.88 | v39.2,16.88 39.2,15.88 v36.7,13.38
  Bottom 0.203: v36.7,57.5 36.7,53.88 v37.58,53 | v34.33,47.88 v37.58,51.12 | v34.33,45.75 38.45,41.62 v38.45,39 | v38.7,29.5 v39.58,30.38 | v39.2,16.88 v39.2,20.88 | v35.7,12.38 v36.7,13.38
N$11
  Top 0.203: J15.TIP@3 6.44,88.33 R65.2
N$12
  Top 0.203: R13.2 10.95,13.39 J4.TIP@3
N$13
  Top 0.381: J14.10 J14.9 52.17,95.63 48.99,98.81 D1.1
N$14
  Top 0.203: U4.7 38.13,66.24 38.2,66.17 40.74,66.17 42.01,64.9 42.01,62.1 R36.2
N$15
  Top 0.203: Q1.B 20.77,92.71 18.52,92.71 15.57,95.65 R18.2
N$16
  Top 0.203: J5.TIP@3 6.45,99.19 9.98,95.65 R18.1
N$17
  Top 0.203: R52.1 29.81,2.13 R53.2 28.8,3.42 29.82,4.45 29.82,7.37 30.07,7.62 30.07,15.37 28.8,16.64 IC3.9
N$18
  Top 0.203: IC3.1 33.18,7.81 C3.2 R8.1 R4.1
N$19
  Top 0.178: IC2.6 IC2.7 39.98,48.33 39.98,45.72 40.49,45.21 40.49,41.02 40.99,40.51 40.99,36.2 41.5,35.69 41.5,24.77 43.03,23.24 R74.2
N$20
  Top 0.203: J13.TIP@3 52.17,3.08 51.23,2.13 R25.1
N$21
  Top 0.203: R24.1 40.1,17.6 J12.TIP@3
N$22  (via drill 0.3)  (1 unrouted)
  Top 0.203: R65.1 9.12,90.28 9.12,86.61 8.48,85.98 8.48,81.92 12.67,77.72 R72.1 10.39,78.49 5.31,78.49 2.89,76.07 2.89,71.5 4.16,70.23 4.16,67.18 2.77,65.79 2.77,56.39 4.16,54.99 4.16,51.94 2.77,50.55 2.77,41.4 4.42,39.75 v4.42,37.34 | C9.1 R66.2 29.07,35.24 28.52,34.7 | 28.52,34.7 R71.1 | IC4.6 31.95,31.47 30.96,30.48 30.2,30.48 29.69,30.99 29.69,33.4 28.46,34.63 | v6.58,37.21 7.29,37.21 9.37,35.13 v12.08,35.13 | v28.09,35.13 28.52,34.7 | v18.22,35.13 v21.2,35.13
  Bottom 0.203: v4.42,37.34 6.45,37.34 v6.58,37.21 | v21.2,35.13 v28.09,35.13 | v12.08,35.13 v18.22,35.13
N$23
  Top 0.203: R10.1 58.01,47.24 D40.-
N$24
  Top 0.203: R53.1 27.27,4.82 27.28,4.83 C2.2 R5.1 27.41,7.37 27.41,8.76 27.98,9.34 IC3.14
N$25
  Top 0.203: Q3.B 52.7,34.67 54.33,34.67 57.88,38.23 R21.2
N$26
  Top 0.178: IC2.14 31.33,54.75 32.45,54.75 IC2.13
N$27
  Top 0.203: U4.6 37.64,66.09 37.95,65.79 40.49,65.79 41.5,64.77 41.5,61.72 42.01,61.21 42.01,57.02 R31.2
N$28
  Top 0.203: D28.+ 25.37,21.17 R62.1
N$29
  Top 0.203: J7.TIP@3 50.43,36.95 Q3.C R19.1
N$30
  Top 0.203: R67.1 D4.+
N$31
  Top 0.203: U3.4 51.66,84.84 52.17,85.34 52.17,88.27 51.03,89.41 46.71,89.41 46.07,90.04 40.99,90.04 R60.2
N$32
  Top 0.203: R61.1 D29.+
N$33
  Top 0.203: J1.TIP@3 6.44,73.09 R14.2
N$34  (via drill 0.3)
  Top 0.203: R28.1 C16.1 R22.2 37.03,24.53 IC4.13 36.95,27.5 36.95,29 35.08,30.88 35.08,36.12 35.7,36.75 v35.7,37.88 | R14.1 12.67,71.49 R30.1 12.67,57.15 13.31,56.52 13.31,48.26 v14.07,47.5 | v31.7,40.25 v36.33,40.25 | v23.58,44.38 v27.58,44.38 | v22.33,44.38 21.39,43.43 v14.83,43.43
  Bottom 0.203: v14.07,47.5 14.07,44.2 v14.83,43.43 | v35.7,37.88 35.7,38.38 36.33,39 v36.33,40.25 | v27.58,44.38 v31.7,40.25 | v22.33,44.38 v23.58,44.38
N$35  (via drill 0.3)
  Top 0.203: U3.5 51.41,85.34 51.79,85.72 51.79,87.88 50.77,88.9 v46.33,88.9 | R33.2 44.8,81.79 v45.82,82.8
  Bottom 0.203: v45.82,82.8 45.82,88.39 v46.33,88.9
N$36  (via drill 0.3)
  Top 0.203: U3.6 50.9,85.85 v51.15,86.11 | v46.07,79.88 46.07,77.6 R55.2
  Bottom 0.203: v51.15,86.11 51.15,84.96 v46.07,79.88
N$37  (via drill 0.3)
  Top 0.203: U3.7 50.27,86.41 50.27,87.63 50.14,87.76 v42.39,87.76 | R35.2 43.03,71.12 41.88,72.26 41.88,76.71 42.26,77.09 v42.26,79.38
  Bottom 0.203: v42.39,87.76 42.39,79.5 v42.26,79.38
N$38
  Top 0.203: R34.2 43.15,66.55 41.76,67.94 41.76,70.74 40.99,71.5 36.3,71.5 35.64,70.84 U4.15
N$39
  Top 0.203: U4.5 37.13,65.96 37.69,65.41 40.23,65.41 40.99,64.64 40.99,57.15 42.01,56.13 42.01,51.94 R32.2
N$40
  Top 0.203: U4.4 36.63,65.83 37.44,65.02 39.98,65.02 40.61,64.39 40.61,56.9 41.5,56.01 41.5,51.82 42.01,51.31 42.01,46.86 R67.2
N$41
  Top 0.203: U4.3 36.12,65.71 37.18,64.64 39.72,64.64 40.23,64.14 40.23,56.64 40.99,55.88 40.99,51.69 41.5,51.18 41.5,46.48 42.01,45.97 42.01,41.78 R54.2
N$42
  Top 0.203: U4.2 35.64,65.56 36.93,64.26 39.47,64.26 39.85,63.88 39.85,56.39 40.49,55.75 40.49,51.56 40.99,51.05 40.99,46.23 41.5,45.72 41.5,41.53 42.01,41.02 42.01,36.7 R56.2
N$43
  Top 0.203: R11.2 31.7,104.78 Q2.B
N$44
  Top 0.203: D41.- 57.88,34.8 R49.1
N$45
  Top 0.203: R48.1 58.01,62.48 D44.-
N$46  (via drill 0.3)
  Top 0.203: C20.1 35.29,44.32 R41.1 34.55,44.42 | 34.55,44.42 R39.2 32.48,46.48 IC2.2 32.45,49.5 32.45,50.12 30.83,51.75 29.33,51.75 R40.1 | v16.45,17.38 15.71,16.62 R13.1 | v16.45,18.88 16.45,22.5 v19.7,25.75 | v18.7,26.75 18.95,26.75 22.33,30.12 23.45,30.12 25.2,31.88 25.2,34.62 27.08,36.5 27.08,39.12 v27.95,40 | v30.45,40.25 30.83,40.25 v31.95,41.38 | v34.45,43.88 34.45,44.38 34.55,44.42
  Bottom 0.203: v16.45,18.88 v16.45,17.38 | v18.7,26.75 v19.7,25.75 | v27.95,40 30.2,40 v30.45,40.25 | v34.45,43.88 v31.95,41.38
N$47
  Top 0.203: J6.TIP@3 21.63,104.78 R11.1
N$48
  Top 0.203: U4.1 35.18,65.38 36.68,63.88 39.22,63.88 39.47,63.63 39.47,56.13 39.98,55.63 39.98,51.44 40.49,50.93 40.49,45.97 40.99,45.47 40.99,41.27 41.5,40.77 41.5,36.45 42.01,35.94 42.01,31.62 R64.2
N$49  (via drill 0.3)
  Top 0.203: v40.36,29.72 40.36,35.18 39.98,35.56 39.98,38.86 39.22,39.62 30.2,39.62 29.56,40.26 U5.5 | R61.2 42.39,25.4 v42.26,25.53
  Bottom 0.203: v40.36,29.72 40.87,29.21 40.87,26.67 42.01,25.53 v42.26,25.53
N$50  (via drill 0.3)
  Top 0.203: U5.15 23.89,43.6 v23.72,43.43 | v19.66,42.16 18.9,41.4 15.85,41.4 13.56,39.12 v13.56,33.53 | v13.56,31.37 13.56,30.23 R59.2
  Bottom 0.203: v19.66,42.16 20.93,43.43 v23.72,43.43 | v13.56,33.53 v13.56,31.37
N$51
  Top 0.203: D3.+ 41.38,88.9 R60.1
N$52  (via drill 0.3)
  Top 0.203: U5.1 23.97,42.16 v23.72,41.91 | R58.2 15.34,30.86 v15.09,31.11 | v15.09,33.27 15.09,34.04 19.91,38.86 19.91,40.39 v20.42,40.89
  Bottom 0.203: v23.72,41.91 21.44,41.91 v20.42,40.89 | v15.09,31.11 v15.09,33.27
N$53  (via drill 0.3)
  Top 0.203: U5.2 27.21,41.22 26.9,41.53 24.74,41.53 v24.61,41.4 | v20.67,40.01 20.67,38.99 16.61,34.92 v16.61,33.66 | R57.2 14.58,21.21 16.48,23.11 16.48,31.24 v16.23,31.5
  Bottom 0.203: v24.61,41.4 24.48,41.4 24.23,41.15 21.82,41.15 v20.67,40.01 | v16.23,31.5 16.23,33.27 v16.61,33.66
N$54
  Top 0.203: U5.3 28.55,39.75 27.53,38.73 27.53,36.32 25.63,34.42 25.63,31.24 25.12,30.73 25.12,29.34 24.1,28.32 24.1,26.29 24.87,25.53 25.5,25.53 R62.2
N$55
  Top 0.203: U5.4 29.06,39.5 28.04,38.48 28.04,35.94 26.26,34.16 R63.2
N$57
  Top 0.203: Q4.B 57.88,22.71 R38.2
N$58
  Top 0.203: J8.TIP@3 51.7,22.98 Q4.C 51.07,20.32 R37.1
N$59
  Top 0.203: R74.1 44.74,16.51 D5.+
N$60  (via drill 0.3)
  Top 0.203: IC2.5 36.3,48.39 36.93,47.75 38.96,47.75 39.47,47.24 39.47,45.47 39.98,44.96 39.98,40.77 40.49,40.26 40.49,35.94 40.99,35.43 v40.99,23.11
  Bottom 0.203: v40.99,23.11 35.66,23.11 34.39,21.84 SJ1.2
N$64
  Top 0.381: J14.2 J14.1 52.68,87.11 52.68,90.3 51.63,91.34 D2.2
N$68
  Top 0.203: Q7.B 53.33,65.15 54.58,65.15 R44.2
N$69
  Top 0.203: J10.TIP@3 51.07,68.06 Q7.C R43.1
N$71
  Top 0.203: R46.2 54.13,49.67 Q8.B
N$72
  Top 0.203: J11.TIP@3 50.55,52.3 Q8.C 48.03,50.62 R45.1
N$73
  Top 0.203: D27.+ 11.19,19.43 R57.1
N$74
  Top 0.203: R56.1 D26.+
N$75
  Top 0.203: D25.+ 13.69,24 R58.1
N$76
  Top 0.203: D24.+ 10.42,29.59 R59.1
N$77
  Top 0.203: D30.+ 26.69,29 R63.1
N$78
  Top 0.203: R64.1 D31.+
N$79
  Top 0.203: D32.+ 42.64,83.31 R33.1
N$80
  Top 0.203: R32.1 D33.+
N$81
  Top 0.203: R31.1 D34.+
N$82
  Top 0.203: R34.1 D35.+
N$83
  Top 0.203: R55.1 D36.+
N$84
  Top 0.203: R54.1 D37.+
N$85
  Top 0.203: R35.1 D38.+
N$86
  Top 0.203: R36.1 D39.+
OUT_ATTACK
  Top 0.203: R44.1 R47.2 57.25,76.07 56.74,76.58 56.74,79.25 57.25,79.76 57.25,81.92 56.74,82.42 53.57,82.42 51.66,84.33 U3.3
OUT_CUR_PRERES  (via drill 0.3)
  Top 0.203: R25.2 R52.2 38.36,1.69 37.44,0.76 27.28,0.76 22.58,5.46 22.58,12.06 v23.72,13.21 | v24.61,14.86 24.61,15.24 26.26,16.89 26.26,17.53 26.64,17.91 IC3.8 30.96,17.91 32.48,19.43 34.01,19.43 v34.64,18.8
  Bottom 0.203: v23.72,13.21 23.72,13.97 v24.61,14.86 | v34.64,18.8 35.2,19.36 SJ1.1
OUT_DECAY  (via drill 0.3)
  Top 0.203: R46.1 R48.2 56.87,60.83 53.95,63.75 50.65,63.75 49.88,64.52 v49.88,65.02 | v49.88,67.44 49.88,70.61 51.03,71.75 51.03,75.31 49.63,76.71 v49.63,79.5 | v50.39,81.03 50.39,82.17 50.19,82.37 U3.2
  Bottom 0.203: v49.88,65.02 v49.88,67.44 | v49.63,79.5 49.63,80.26 v50.39,81.03
OUT_LIN_PRERES  (via drill 0.3)
  Top 0.203: R24.2 37.54,18.64 R6.2 35.3,17.91 IC3.7 33.18,18.48 v33.37,18.67
  Bottom 0.203: v33.37,18.67 33.58,18.87 SJ1.3
OUT_RELEASEDONE  (via drill 0.3)
  Top 0.203: R38.1 R49.2 57,30.35 54.2,33.15 49.5,33.15 v48.49,34.16 | v48.49,37.08 48.49,39.12 46.96,40.64 46.96,49.28 v47.34,49.66 | v47.34,52.07 46.96,52.45 46.96,64.77 v47.22,65.02 | v47.22,67.18 46.96,67.44 46.96,80.77 47.8,81.61 U3.15
  Bottom 0.203: v48.49,34.16 v48.49,37.08 | v47.34,49.66 v47.34,52.07 | v47.22,65.02 v47.22,67.18
OUT_RELEASESTART  (via drill 0.3)
  Top 0.203: R21.1 R10.2 55.09,48.39 50.39,48.39 v49.12,49.66 | v49.12,51.69 49.12,55.37 50.27,56.52 50.27,60.07 48.74,61.59 v48.74,65.02 | v48.74,67.44 48.74,70.48 50.27,72.01 50.27,75.18 48.87,76.58 48.87,80.39 v48.74,80.52 | 49.5,82.04 49.63,81.92 v49.63,81.79 49.25,82.17 U3.1
  Bottom 0.203: v49.12,49.66 v49.12,51.69 | v48.74,65.02 v48.74,67.44 | v48.74,80.52 48.74,80.9 v49.63,81.79
PTA6  (via drill 0.3)
  Top 0.203: U1.8 31.57,71.73 v31.47,71.63
  Bottom 0.203: v31.47,71.63 29.7,71.63 TP1.TP
REF_-5V  (via drill 0.3)
  Top 0.203: R26.2 14.6,91.23 U2.2 14.07,90.71 C6.2 14.07,78.61 v15.72,76.96 | R3.2 R28.2 38.2,20.12 38.2,19.75 37.83,19.38 35.08,19.38 v33.08,21.38 | v16.61,74.8 21.44,74.8 22.45,73.79 22.45,71.25 21.69,70.48 21.69,65.91 v22.2,65.41 | v23.72,64.9 23.72,63.63 v24.74,62.61 | 28.65,53.94 24.74,57.85 v24.74,60.58 | 28.65,53.94 R40.2 | 27.64,31.56 29.2,30 29.2,20.62 29.58,20.25 29.95,20.25 | 27.64,31.56 27.45,31.75 27.45,32 R71.2 | 29.95,20.25 30.7,20.25 R15.2 | 29.95,20.25 v30.95,19.25 | v27.2,31.12 27.64,31.56 | v24.45,33.88 24.45,35.75 22.83,37.38 22.83,38.88 24.7,40.75 v25.97,40.75 | v25.95,45.11 25.95,50.37 v27.08,51.5 | 28.65,53.94 v29.08,54.38
  Bottom 0.203: v15.72,76.96 15.72,75.69 v16.61,74.8 | v22.2,65.41 23.21,65.41 v23.72,64.9 | v24.74,62.61 v24.74,60.58 | v30.95,19.25 v33.08,21.38 | v24.45,33.88 v27.2,31.12 | v25.97,40.75 25.71,40.75 25.95,40.99 v25.95,45.11 | v27.08,51.5 29.08,53.5 v29.08,54.38
RETRIGGER_ENVELOPE
  Top 0.203: Q2.C 26.13,103.63 25.75,103.25 25.75,101.98 27.53,100.2 27.64,100.31 | 27.64,100.31 27.66,100.33 | 27.64,100.31 27.58,100.38 R42.1
SCL  (via drill 0.3)
  Top 0.203: R50.2 34.78,84.67 U6.1 35.28,84.1 v35.28,81.66 | v36.17,79.12 36.17,77.22 35.71,76.76 U1.17
  Bottom 0.203: v35.28,81.66 35.28,81.03 36.17,80.14 v36.17,79.12
SDA  (via drill 0.3)
  Top 0.203: R51.2 37.73,84.67 U6.3 v37.18,82.42 | v37.44,80.14 37.18,79.88 35.79,79.88 34.53,78.63 U1.18
  Bottom 0.203: v37.18,82.42 37.44,82.17 v37.44,80.14
SHIFTER1TO2  (via drill 0.3)
  Top 0.203: U3.9 48.66,86.87 40.61,86.87 v40.23,87.25 | U4.14 36.12,70.69 36.42,70.99 38.07,70.99 v38.2,70.87 | v38.45,72.26 38.45,72.64 39.47,73.66 v39.47,79.5
  Bottom 0.203: v38.2,70.87 38.2,72.01 v38.45,72.26 | v39.47,79.5 40.36,80.39 40.36,85.09 39.98,85.47 39.98,86.87 40.23,87.12 v40.23,87.25
SHIFTER2TO3  (via drill 0.3)
  Top 0.203: v28.58,44.62 28.58,43.62 U5.14 | v33.58,52.62 v35.08,51.12 | v33.08,62.25 35.2,64.38 v35.2,64.5 | v39.58,68.88 39.08,68.88 38.7,68.5 U4.9
  Bottom 0.203: v35.08,51.12 v28.58,44.62 | v33.58,52.62 33.08,53.12 v33.08,62.25 | v39.58,68.88 v35.2,64.5
SHIFTERS  (via drill 0.3)
  Top 0.203: U1.2 28.75,76.76 27.79,77.72 27.79,78.87 28.29,79.38 v30.07,79.38 | U3.14 47.09,84.33 46.84,84.07 46.84,81.79 45.31,80.26 39.09,80.26 v37.18,78.36
  Bottom 0.203: v37.18,78.36 31.09,78.36 v30.07,79.38
SWD_CLK  (via drill 0.3)
  Top 0.203: U1.22 32.08,80.29 30.58,81.79 29.56,81.79 28.93,82.42 28.93,86.11 v28.55,86.49
  Bottom 0.203: v28.55,86.49 28.22,86.82 SWD1.4
SWD_DIO  (via drill 0.3)
  Top 0.203: v27.79,84.84 27.79,81.5 29.15,80.14 30.45,80.14 31.09,79.5 U1.24
  Bottom 0.203: v27.79,84.84 26.95,85.68 SWD1.2
TRIGGER_ENVELOPE  (via drill 0.3)
  Top 0.203: R20.1 24.89,91.7 | 24.89,91.7 Q1.C | U1.13 35.02,74.75 35.53,74.25 v35.53,73.79 | 24.89,91.7 24.89,89.05 21.31,85.47 21.31,82.3 v22.33,81.28 | v30.33,73.03 29.44,72.14 26.39,72.14 24.87,73.66 v24.87,74.42 | v23.98,81.03 24.87,80.14 v24.87,77.09
  Bottom 0.203: v30.33,73.03 34.77,73.03 v35.53,73.79 | v22.33,81.28 23.72,81.28 v23.98,81.03 | v24.87,77.09 v24.87,74.42